# Altium schematic sheet Cover Page.SchDoc: Cover Page
size Letter; Organization: IT Logic; Address1: 5753 Highway 85 N; Address2: Crestview, FL 32536; Address3: United States; DocumentNumber: 1; SheetNumber: 1; SheetTotal: 5; Email: pcb-design@itlogic.cloud
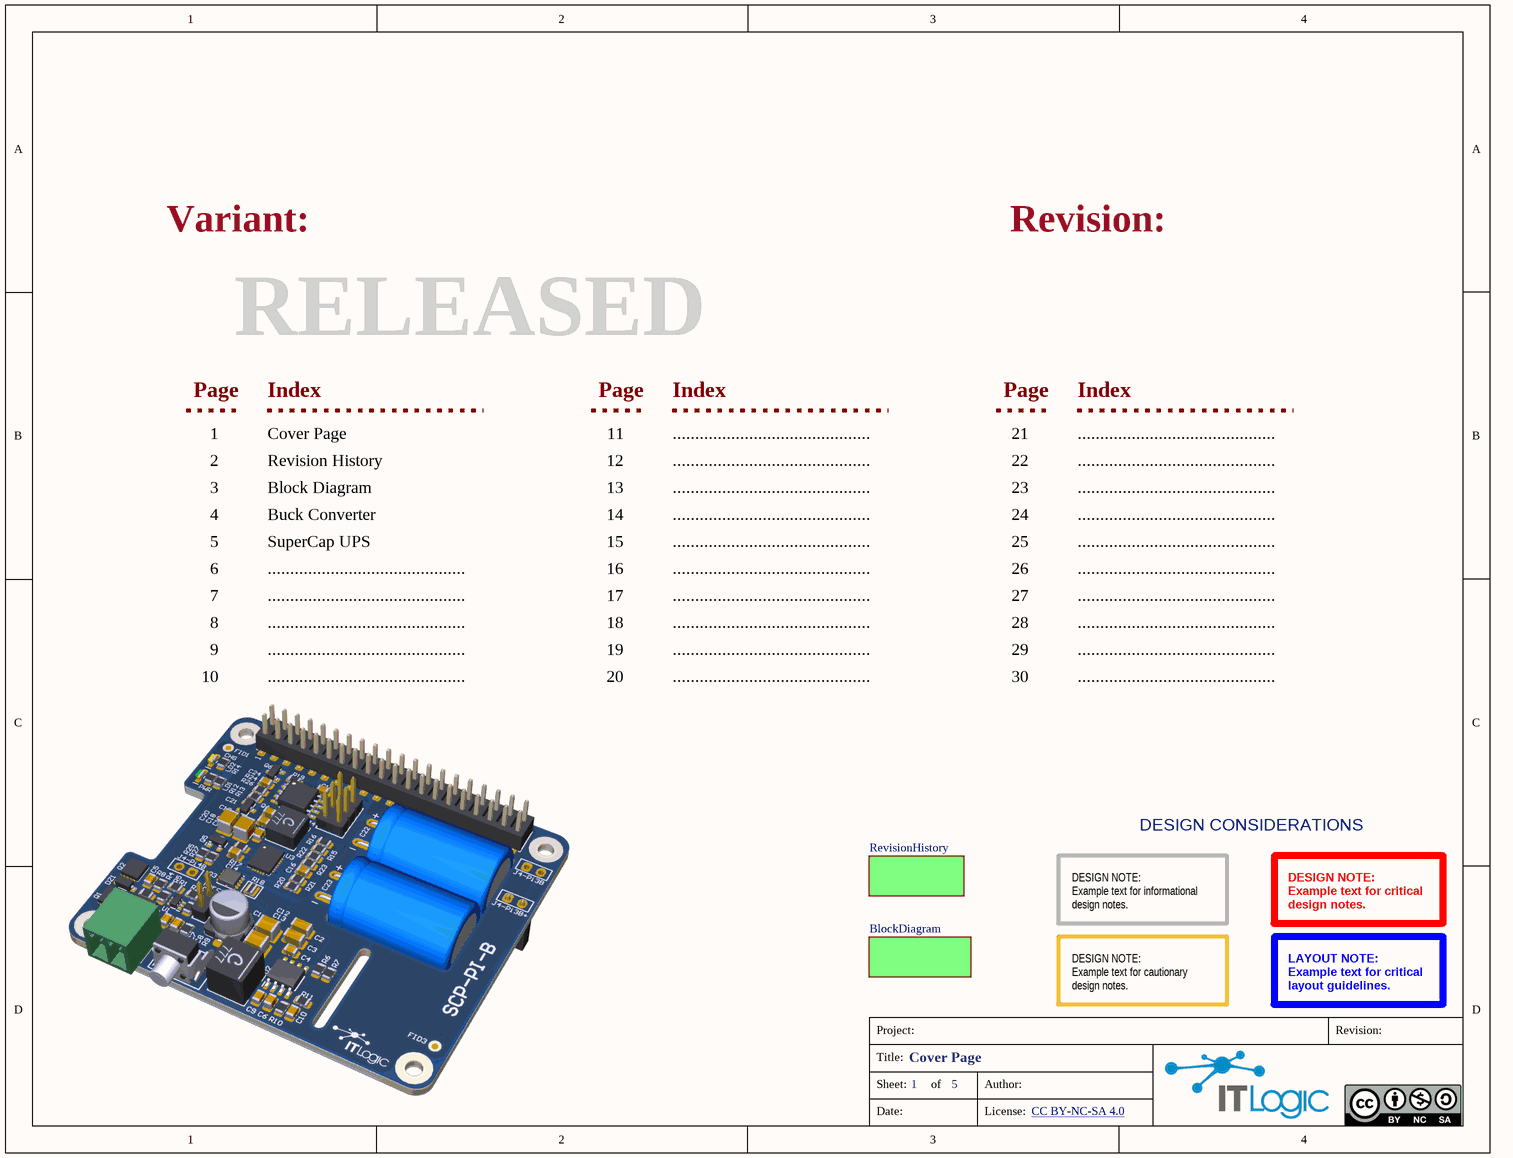
[diagram p0: Cover Page.SchDoc]

## Sub-sheets
BlockDiagram = Block Diagram.SchDoc: no entries
RevisionHistory = Revision History.SchDoc: no entries

## Notes on the sheet
- Variant:
- Revision:
- RELEASED
- Page
- Index
- 1
- 2
- 3
- Cover Page
- Revision History
- Block Diagram
- 11
- 12
- 13
- ............................................
- 21
- 22
- 23
- 4
- 5
- Buck Converter
- SuperCap UPS
- 14
- 15
- 24
- 25
- 6
- 7
- 8
- 16
- 17
- 18
- 26
- 27
- 28
- 9
- 10
- 19
- 20
- 29
- 30
- DESIGN CONSIDERATIONS
- DESIGN NOTE:
  Example text for informational
  design notes.
- DESIGN NOTE:
  Example text for critical
  design notes.
- DESIGN NOTE:
  Example text for cautionary
  design notes.
- LAYOUT NOTE:
  Example text for critical
  layout guidelines.
- Project:
- Title:
- Sheet:
- of
- Author:
- Date:
- License:
- CC BY-NC-SA 4.0 <https://creativecommons.org/licenses/by-nc-sa/4.0/>